# EAGLE design atmega128 (EAGLE 7.6.0)
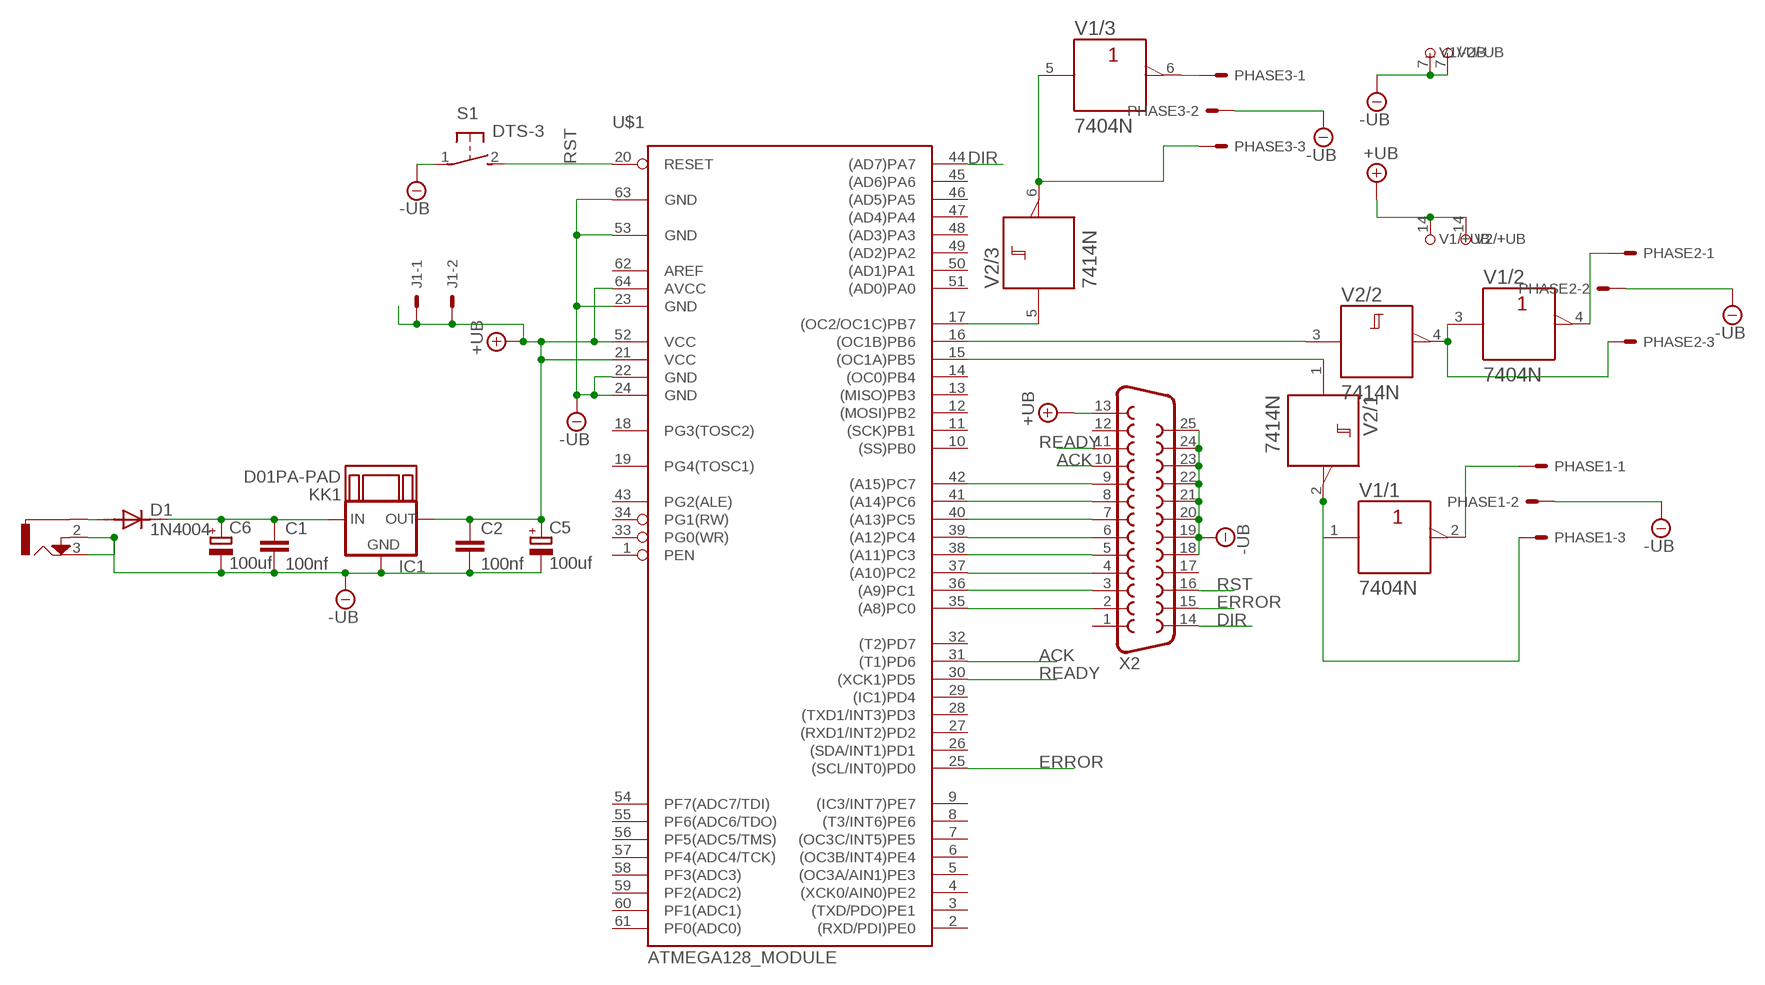
[diagram p0: schematic, sheet 1]

## Parts
C1  100nf  C-EU025-025X050  [C025-025X050]
C2  100nf  C-EU025-025X050  [C025-025X050]
C5  100uf  CPOL-EUE2.5-6  [E2,5-6]
C6  100uf  CPOL-EUE2.5-6  [E2,5-6]
D1  1N4004  [DO41-10]
IC1  78XXS  [78XXS]
J1  22-27-2021-02  [6410-02]
KK1  D01PA-PAD  [D01PA-PAD]
PHASE1  22-27-2031-03  [6410-03]
PHASE2  22-27-2031-03  [6410-03]
PHASE3  22-27-2031-03  [6410-03]
S1  DTS-3  [DTS-3]
U$1  ATMEGA128_MODULE  [ATMEGA128_MODULE]
U$2  DC-21MM  [DC-21MM]
V1  7404N  [DIL14]
V2  7414N  [DIL14]
X2  F25HP  [F25HP]

## Nets
+UB: C2.1 C5.+ IC1.OUT J1.1 J1.2 U$1.21(VCC) U$1.52(VCC) U$1.64(AVCC) V1.14(/+UB:+UB) V2.14(/+UB:+UB) X2.13
-UB: C1.2 C2.2 C5.- C6.- IC1.GND PHASE1.2 PHASE2.2 PHASE3.2 S1.1 U$1.22(GND) U$1.23(GND) U$1.24(GND) U$1.53(GND) U$1.63(GND) U$2.2 U$2.3 V1.7(/-UB:-UB) V2.7(/-UB:-UB) X2.18 X2.19 X2.20 X2.21 X2.22 X2.23 X2.24 X2.25
ACK: U$1.31((T1)PD6) X2.10
DIR: U$1.44((AD7)PA7) X2.14
ERROR: U$1.25((SCL/INT0)PD0) X2.15
N$1: D1.A U$2.1
N$2: C1.1 C6.+ D1.C IC1.IN
N$6: U$1.42((A15)PC7) X2.9
N$7: U$1.41((A14)PC6) X2.8
N$8: U$1.40((A13)PC5) X2.7
N$9: U$1.39((A12)PC4) X2.6
N$10: U$1.38((A11)PC3) X2.5
N$11: U$1.37((A10)PC2) X2.4
N$12: U$1.36((A9)PC1) X2.3
N$13: U$1.35((A8)PC0) X2.2
PHASE1: U$1.15((OC1A)PB5) V2.1(/1:A)
PHASE1HIGH: PHASE1.1 V1.2(/1:Y)
PHASE1LOW: PHASE1.3 V1.1(/1:A) V2.2(/1:Y)
PHASE2: U$1.16((OC1B)PB6) V2.3(/2:A)
PHASE2HIGH: PHASE2.1 V1.4(/2:Y)
PHASE2LOW: PHASE2.3 V1.3(/2:A) V2.4(/2:Y)
PHASE3: U$1.17((OC2/OC1C)PB7) V2.5(/3:A)
PHASE3HIGH: PHASE3.1 V1.6(/3:Y)
PHASE3LOW: PHASE3.3 V1.5(/3:A) V2.6(/3:Y)
READY: U$1.30((XCK1)PD5) X2.11
RST: S1.2 U$1.20(RESET) X2.16
Unconnected: U$1.1(PEN) U$1.2((RXD/PDI)PE0) U$1.3((TXD/PDO)PE1) U$1.4((XCK0/AIN0)PE2) U$1.5((OC3A/AIN1)PE3) U$1.6((OC3B/INT4)PE4) U$1.7((OC3C/INT5)PE5) U$1.8((T3/INT6)PE6) U$1.9((IC3/INT7)PE7) U$1.10((SS)PB0) U$1.11((SCK)PB1) U$1.12((MOSI)PB2) U$1.13((MISO)PB3) U$1.14((OC0)PB4) U$1.18(PG3(TOSC2)) U$1.19(PG4(TOSC1)) U$1.26((SDA/INT1)PD1) U$1.27((RXD1/INT2)PD2) U$1.28((TXD1/INT3)PD3) U$1.29((IC1)PD4) U$1.32((T2)PD7) U$1.33(PG0(WR)) U$1.34(PG1(RW)) U$1.43(PG2(ALE)) U$1.45((AD6)PA6) U$1.46((AD5)PA5) U$1.47((AD4)PA4) U$1.48((AD3)PA3) U$1.49((AD2)PA2) U$1.50((AD1)PA1) U$1.51((AD0)PA0) U$1.54(PF7(ADC7/TDI)) U$1.55(PF6(ADC6/TDO)) U$1.56(PF5(ADC5/TMS)) U$1.57(PF4(ADC4/TCK)) U$1.58(PF3(ADC3)) U$1.59(PF2(ADC2)) U$1.60(PF1(ADC1)) U$1.61(PF0(ADC0)) U$1.62(AREF) V1.8(/4:Y) V1.9(/4:A) V1.10(/5:Y) V1.11(/5:A) V1.12(/6:Y) V1.13(/6:A) V2.8(/4:Y) V2.9(/4:A) V2.10(/5:Y) V2.11(/5:A) V2.12(/6:Y) V2.13(/6:A) X2.1 X2.12 X2.17

## Library data of the parts
C1 C2 = rcl:C-EU: CAPACITOR, European symbol
C5 C6 = rcl:CPOL-EU: POLARIZED CAPACITOR, European symbol
D1 = diode:1N4004: DIODE general purpose rectifier, 1 A
IC1 = v-reg:78XXS: VOLTAGE REGULATOR
J1 = con-molex:22-?-02: CONNECTOR wire to board 2.54 mm (.1 inch) pitch header; OC_FARNELL: unknown; OC_NEWARK: unknown
KK1 = heatsink:D01PA-PAD: HEATSINK distributor Schukat
PHASE1-PHASE3 = con-molex:22-?-03: CONNECTOR wire to board 2.54 mm (.1 inch) pitch header; OC_FARNELL: unknown; OC_NEWARK: unknown
S1 = switch-tact:DTS-3
U$1 = module:ATMEGA128_MODULE
U$2 = arduino_Uno_Rev3-02-TH:DC-21MM
V1 = 74ttl-din:74*04: Hex INVERTER
V2 = 74ttl-din:74*14: Hex schmitt trigger INVERTER
X2 = con-subd:F25: SUB-D; OC_FARNELL: unknown; OC_NEWARK: unknown

## Net classes
0 default: width 0.61 mm, clearance 0.305 mm

## Board
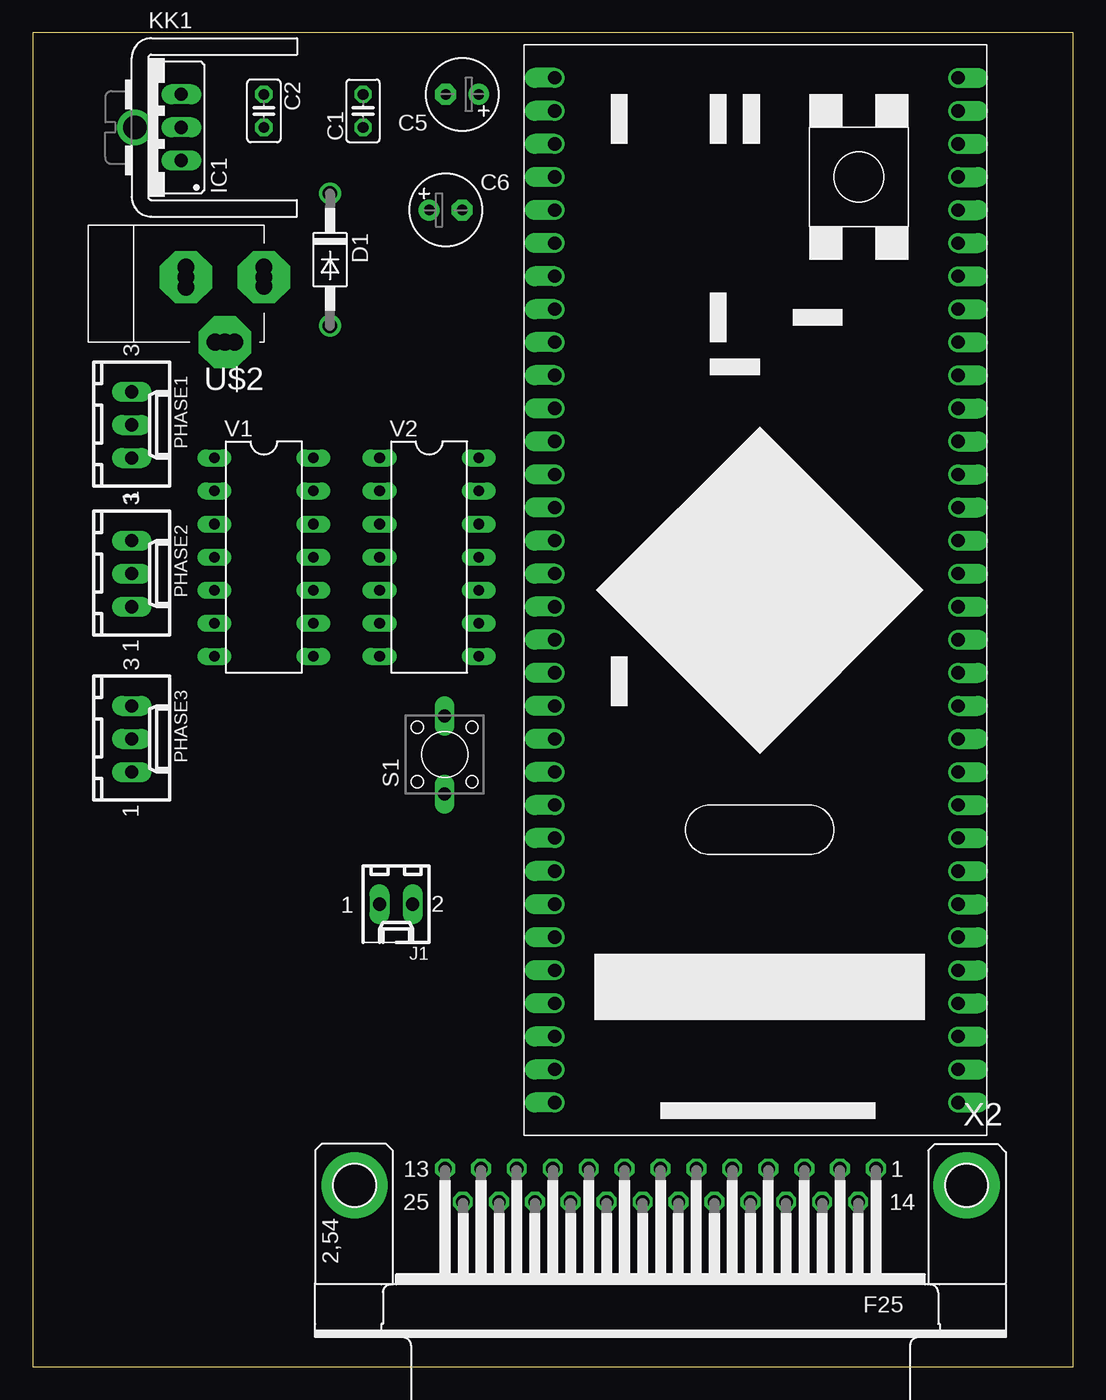
[diagram p1: board, top side]
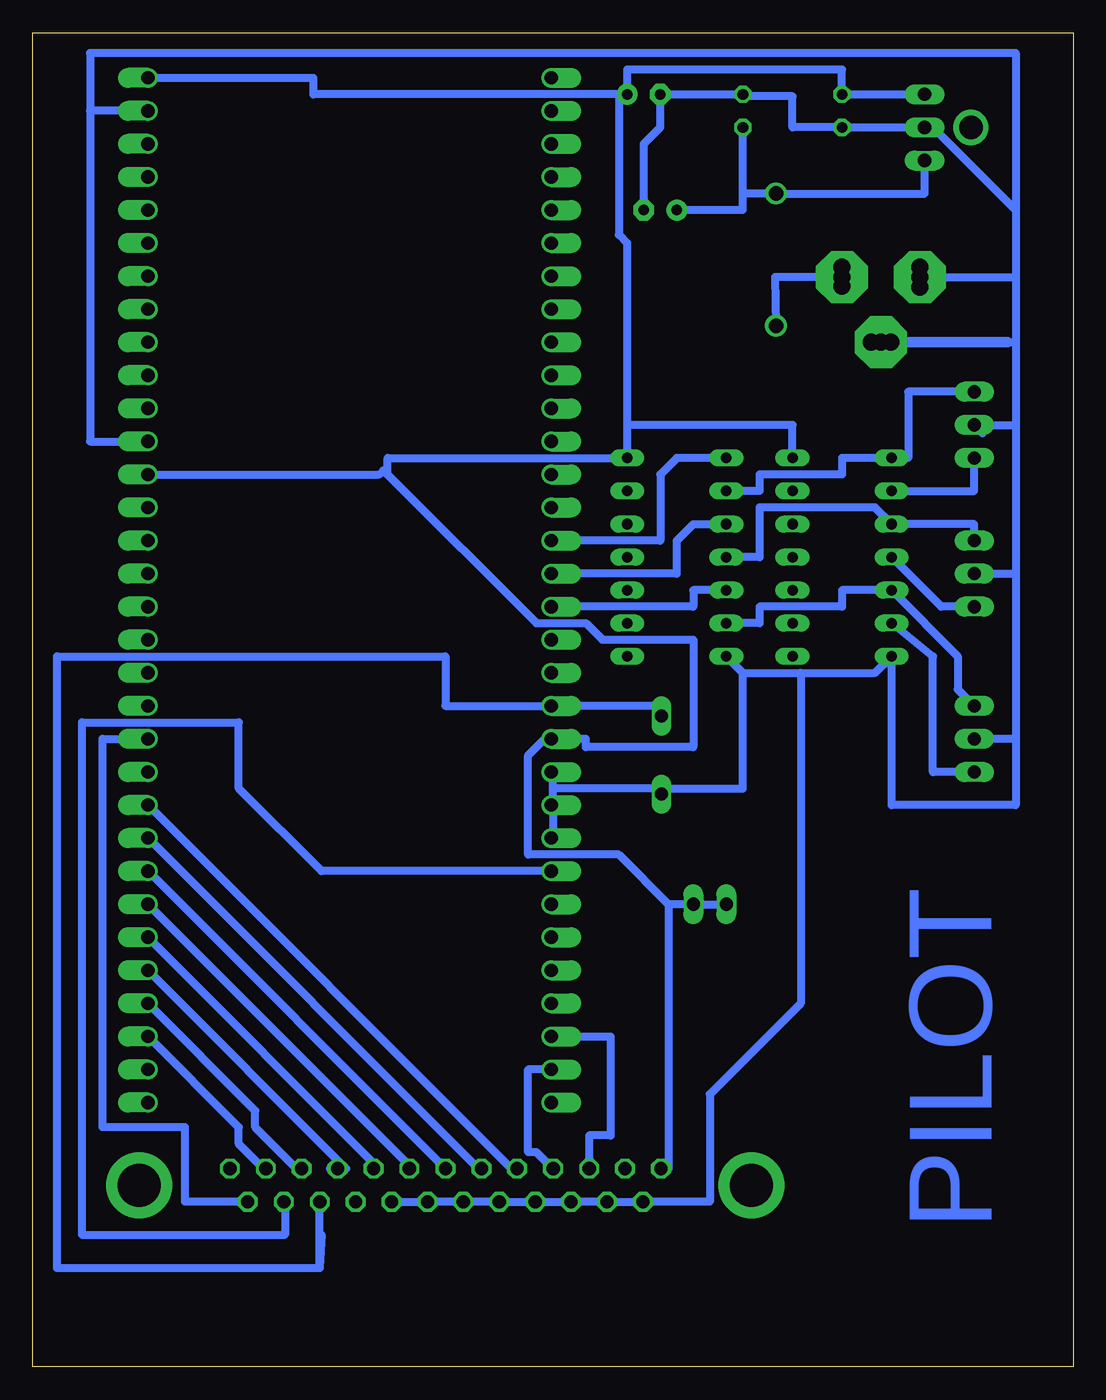
[diagram p2: board, bottom side, seen from below]

Size 79.99 x 102.54 mm. Coordinates in mm from the lower left corner, seen from the top.
Outline: 0,0 79.99,0 79.99,102.54 0,102.54 0,0
Copper layers (1*16): Top 0.035mm / dielectric 1.5mm / Bottom 0.035mm
Design rules "default": minimum track width 10mil, minimum drill 24mil, track to track 8mil, track to pad 8mil, pad to pad 8mil, via to via 8mil, smd to smd 8mil, copper to edge 40mil, drill to drill 8mil, minimum pad ring 10mil, minimum via ring 8mil, stop-mask expansion 4mil, vias tented up to drill 0mil, thermal gap 10mil

### Footprints (pad centres in the part's own frame; a part is rotated, then mirrored left to right if it is on the bottom)
C025-025X050 = drill 0.813 octagon: 1 -1.27,0; 2 1.27,0
E2,5-6 = drill 0.813 pad 1.6: + -1.27,0 | drill 0.813 pad 1.6 octagon: - 1.27,0
DO41-10 = drill 1.118: A 5.08,0; C -5.08,0
78XXS = drill 1.016 long: GND 0,-2.54; IN -2.54,-2.54; OUT 2.54,-2.54
6410-02 = drill 1.016 long: 1 1.27,0; 2 -1.27,0
D01PA-PAD = drill 1.803 pad 2.54: B 0,-1.016
6410-03 = drill 1.016 long: 1 2.54,0; 2 0,0; 3 -2.54,0
DTS-3 = drill 1 long: 1 -2.971,0.075; 2 3.029,0.075
ATMEGA128_MODULE = drill 1.016 offset: 1 -15.748,38.1; 2 -15.748,35.56; 3 -15.748,33.02; 4 -15.748,30.48; 5 -15.748,27.94; 6 -15.748,25.4; 7 -15.748,22.86; 8 -15.748,20.32; 9 -15.748,17.78; 10 -15.748,15.24; 11 -15.748,12.7; 12 -15.748,10.16; 13 -15.748,7.62; 14 -15.748,5.08; 15 -15.748,2.54; 16 -15.748,0; 17 -15.748,-2.54; 18 -15.748,-5.08; 19 -15.748,-7.62; 20 -15.748,-10.16; 21 -15.748,-12.7; 22 -15.748,-15.24; 23 -15.748,-17.78; 24 -15.748,-20.32; 25 -15.748,-22.86; 26 -15.748,-25.4; 27 -15.748,-27.94; 28 -15.748,-30.48; 29 -15.748,-33.02; 30 -15.748,-35.56; 31 -15.748,-38.1; 32 -15.748,-40.64; 33 15.24,-40.64; 34 15.24,-38.1; 35 15.24,-35.56; 36 15.24,-33.02; 37 15.24,-30.48; 38 15.24,-27.94; 39 15.24,-25.4; 40 15.24,-22.86; 41 15.24,-20.32; 42 15.24,-17.78; 43 15.24,-15.24; 44 15.24,-12.7; 45 15.24,-10.16; 46 15.24,-7.62; 47 15.24,-5.08; 48 15.24,-2.54; 49 15.24,0; 50 15.24,2.54; 51 15.24,5.08; 52 15.24,7.62; 53 15.24,10.16; 54 15.24,12.7; 55 15.24,15.24; 56 15.24,17.78; 57 15.24,20.32; 58 15.24,22.86; 59 15.24,25.4; 60 15.24,27.94; 61 15.24,30.48; 62 15.24,33.02; 63 15.24,35.56; 64 15.24,38.1
DC-21MM = drill 1.3 pad 4 octagon: 1 -0.076,-3.175; 2 -5.08,-0.178; 3 -0.076,2.819 | drill 1.3: P$1 -0.838,2.819; P$2 -0.762,-3.175; P$3 0.686,2.819; P$4 0.686,-3.175; P$5 -5.08,-0.94; P$6 -5.08,0.584
DIL14 = drill 0.813 long: 1 -7.62,-3.81; 2 -5.08,-3.81; 3 -2.54,-3.81; 4 0,-3.81; 5 2.54,-3.81; 6 5.08,-3.81; 7 7.62,-3.81; 8 7.62,3.81; 9 5.08,3.81; 10 2.54,3.81; 11 0,3.81; 12 -2.54,3.81; 13 -5.08,3.81; 14 -7.62,3.81
F25HP = drill 1.016 octagon: 1 -16.561,-1.27; 2 -13.792,-1.27; 3 -11.049,-1.27; 4 -8.28,-1.27; 5 -5.512,-1.27; 6 -2.769,-1.27; 7 0,-1.27; 8 2.769,-1.27; 9 5.512,-1.27; 10 8.28,-1.27; 11 11.049,-1.27; 12 13.792,-1.27; 13 16.561,-1.27; 14 -15.189,1.27; 15 -12.421,1.27; 16 -9.652,1.27; 17 -6.909,1.27; 18 -4.14,1.27; 19 -1.372,1.27; 20 1.372,1.27; 21 4.14,1.27; 22 6.909,1.27; 23 9.652,1.27; 24 12.421,1.27; 25 15.189,1.27 | drill 3.302 pad 5.08: G1 -23.52,0; G2 23.52,0

### Placement (x,y rotation side)
C1  25.4,96.52 90 top
C2  17.78,96.52 270 top
C5  33.02,97.79 180 top
C6  31.75,88.9 0 top
D1  22.86,85.09 270 top
IC1  8.89,95.25 90 top
J1  27.94,35.56 180 top
KK1  8.89,95.25 270 top
PHASE1  7.62,72.39 270 top
PHASE2  7.62,60.96 270 top
PHASE3  7.62,48.26 270 top
S1  31.75,46.99 90 top
U$1  55.88,60.96 0 top
U$2  14.6,83.82 90 top
V1  17.78,62.23 270 top
V2  30.48,62.23 270 top
X2  48.26,13.97 180 top

### Tracks (layer width: path | path; a pad name or v marks a point on that pad's centre or on a via)
+UB
  Bottom 0.61: 73.03,99.06 U$1.64 58.42,99.06 58.42,97.79 34.92,97.79 | IC1.OUT C2.1 17.78,99.69 34.29,99.69 C5.+ 34.92,97.79 | 31.75,15.24 X2.13 31.12,15.24 31.12,35.56 | 52.7,68.58 53.02,68.9 53.34,68.58 U$1.52 | 52.7,68.58 41.27,57.15 37.46,57.15 36.2,55.88 29.21,55.88 29.21,47.62 37.46,47.62 37.46,48.26 39.69,48.26 39.69,47.94 40,48.26 U$1.21 40.64,48.26 41.91,46.99 41.91,39.37 34.92,39.37 31.12,35.56 | 34.29,72.39 34.29,86.36 34.92,87 34.92,97.79 | 34.29,72.39 V2.14 52.7,69.85 52.7,68.58 | V1.14 21.59,72.39 34.29,72.39 | J1.1 J1.2 31.12,35.56
-UB
  Bottom 0.61: IC1.GND C2.2 21.59,95.25 21.59,97.63 25.24,97.63 C1.2 C5.- 31.75,95.25 33.02,93.98 C6.- | 11.11,95.57 IC1.GND | 75.56,96.52 75.56,71.12 U$1.53 | U$1.63 75.56,96.52 | 75.56,96.52 75.56,100.97 4.45,100.97 4.45,88.9 | 6.98,71.75 PHASE1.2 4.45,72.39 | X2.18 X2.19 X2.20 X2.21 X2.22 X2.23 X2.24 X2.25 27.94,12.7 27.94,20.96 20.95,27.94 20.95,53.34 | 40,43.18 40,40.64 U$1.24 | 40,43.18 40,44.45 | 40,44.45 40,45.72 U$1.22 | 40,43.18 U$1.23 | 40,44.45 31.75,44.45 S1.1 31.12,44.45 25.4,44.45 25.4,53.34 | 4.45,48.26 PHASE3.2 | 25.4,53.34 20.95,53.34 | 20.95,53.34 15.24,53.34 V1.7 13.97,43.18 4.45,43.18 4.45,48.26 | V2.7 25.4,53.34 | 4.45,88.9 4.45,83.82 | 4.45,83.82 4.45,78.74 | 4.45,78.74 4.45,72.39 | 4.45,72.39 4.45,60.96 | 4.45,60.96 4.45,48.26 | 4.45,88.9 10.79,95.25 IC1.GND | U$2.3 4.52,83.74 4.45,83.82 | 5.08,78.74 4.45,78.74 | PHASE2.2 4.45,60.96
  Bottom 0.813: U$2.2 5.08,78.74
ACK
  Bottom 0.61: X2.10 40,15.24 41.27,16.51 41.91,16.51 41.91,22.86 U$1.31
DIR
  Bottom 0.61: U$1.44 74.61,48.26 74.61,18.41 68.26,18.41 68.26,12.7 X2.14
ERROR
  Bottom 0.61: 60.8,12.7 X2.15 60.58,12.7 60.58,10.16 76.2,10.16 76.2,49.53 64.14,49.53 64.14,44.45 57.78,38.1 U$1.25
N$1
  Bottom 0.61: U$2.1 22.94,83.74 D1.A
N$2
  Bottom 0.61: C6.+ 25.4,88.9 25.4,90.17 | IC1.IN 11.43,90.17 D1.C 25.4,90.17 | 25.4,90.17 C1.1
N$6
  Bottom 0.61: X2.9 43.18,15.24 U$1.42
N$7
  Bottom 0.61: X2.8 45.72,15.24 U$1.41
N$8
  Bottom 0.61: X2.7 U$1.40
N$9
  Bottom 0.61: X2.6 50.8,15.24 U$1.39
N$10
  Bottom 0.61: 53.97,15.24 X2.5 53.34,15.24 U$1.38
N$11
  Bottom 0.61: 57.15,15.24 X2.4 55.88,15.24 U$1.37
N$12
  Bottom 0.61: X2.3 59.69,15.24 62.86,18.41 62.86,19.69 U$1.36
N$13
  Bottom 0.61: X2.2 62.23,15.24 64.14,17.14 64.14,18.41 U$1.35
PHASE1
  Bottom 0.61: U$1.15 31.75,63.5 31.75,68.58 30.48,69.85 V2.1
PHASE1HIGH
  Bottom 0.61: V1.2 7.62,67.31 PHASE1.1
PHASE1LOW
  Bottom 0.61: PHASE1.3 12.7,74.93 12.7,69.85 V1.1 17.78,69.85 17.78,68.58 24.13,68.58 24.13,67.31 V2.2
PHASE2
  Bottom 0.61: U$1.16 30.48,60.96 30.48,63.5 29.21,64.77 V2.3
PHASE2HIGH
  Bottom 0.61: V1.4 10.16,58.42 PHASE2.1
PHASE2LOW
  Bottom 0.61: PHASE2.3 7.62,64.77 V1.3 15.24,66.04 24.13,66.04 24.13,62.23 V2.4
PHASE3
  Bottom 0.61: U$1.17 29.21,58.42 29.21,59.69 V2.5
PHASE3HIGH
  Bottom 0.61: V1.6 10.79,54.61 10.79,45.72 PHASE3.1
PHASE3LOW
  Bottom 0.61: V2.6 24.13,57.15 24.13,58.42 17.78,58.42 17.78,59.69 V1.5 8.89,54.61 8.89,52.07 PHASE3.3
READY
  Bottom 0.61: 37.46,15.24 X2.11 37.21,17.78 35.56,17.78 35.56,25.4 U$1.30
RST
  Bottom 0.61: 32.07,50.8 31.75,51.12 S1.2 31.75,50.8 U$1.20 48.26,50.8 48.26,54.61 78.11,54.61 78.11,7.62 57.91,7.62 | 57.78,10.16 57.91,7.62 | 57.91,7.62 X2.16

### Text on the board
Bottom: PILOT